# EAGLE design controller (EAGLE 7.3.0)
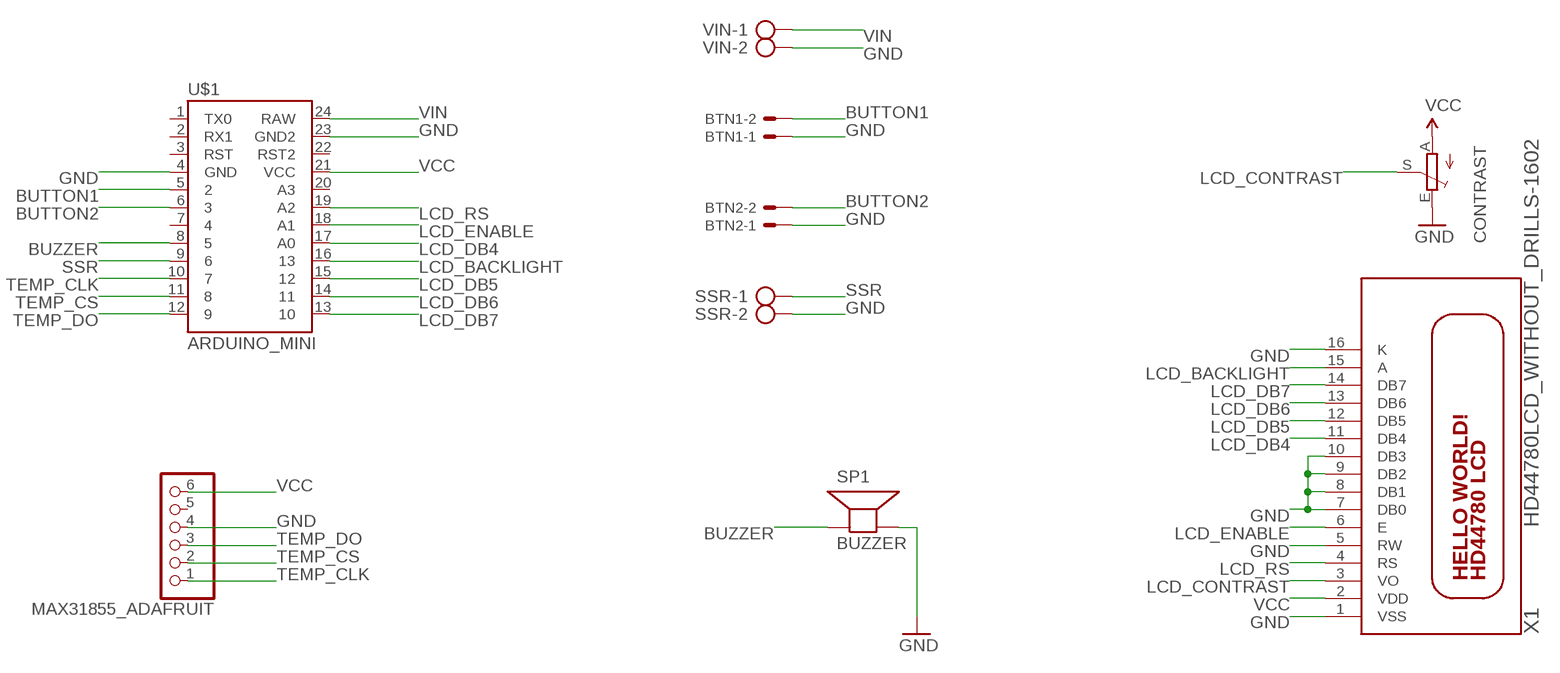
[diagram p0: schematic, sheet 1]

## Parts
BTN1  22-27-2021-02  [6410-02]
BTN2  22-27-2021-02  [6410-02]
CONTRAST  TRIM_EU-B25U  [B25U]
MAX31855_ADAFRUIT  PINHD-1X6  [1X06]
SP1  BUZZER  SPEAKER/PS12  [PS12]
SSR  AK500/2  [AK500/2]
U$1  ARDUINO_MINI  [ARDUINO_MINI]
VIN  AK500/2  [AK500/2]
X1  HD44780LCD_WITHOUT_DRILLS-1602  [LCD1602]

## Nets
BUTTON1: BTN1.2 U$1.5
BUTTON2: BTN2.2 U$1.6
BUZZER: SP1.P$1(+) U$1.8
GND: BTN1.1 BTN2.1 CONTRAST.E MAX31855_ADAFRUIT.4 SP1.P$2(-) SSR.2 U$1.4(GND) U$1.23(GND2) VIN.2 X1.1(VSS) X1.5(RW) X1.7(DB0) X1.8(DB1) X1.9(DB2) X1.10(DB3) X1.16(K)
LCD_BACKLIGHT: U$1.16 X1.15(A)
LCD_CONTRAST: CONTRAST.S X1.3(VO)
LCD_DB4: U$1.17(A0) X1.11(DB4)
LCD_DB5: U$1.15 X1.12(DB5)
LCD_DB6: U$1.14 X1.13(DB6)
LCD_DB7: U$1.13 X1.14(DB7)
LCD_ENABLE: U$1.18(A1) X1.6(E)
LCD_RS: U$1.19(A2) X1.4(RS)
SSR: SSR.1 U$1.9
TEMP_CLK: MAX31855_ADAFRUIT.1 U$1.10
TEMP_CS: MAX31855_ADAFRUIT.2 U$1.11
TEMP_DO: MAX31855_ADAFRUIT.3 U$1.12
VCC: CONTRAST.A MAX31855_ADAFRUIT.6 U$1.21(VCC) X1.2(VDD)
VIN: U$1.24(RAW) VIN.1
Unconnected: MAX31855_ADAFRUIT.5 U$1.1(TX0) U$1.2(RX1) U$1.3(RST) U$1.7 U$1.20(A3) U$1.22(RST2)

## Library data of the parts
BTN1 BTN2 = kalanda:22-?-02: CONNECTOR wire to board 2.54 mm (.1 inch) pitch header
CONTRAST = kalanda:TRIM_EU-: POTENTIOMETER
MAX31855_ADAFRUIT = pinhead:PINHD-1X6: PIN HEADER
SP1 = adafruit:SPEAKER: SPEAKER Source: Buerklin Added PS12 (for part # PS1240 piezo) http://www.ladyada.net/library/pcb/eaglelibrary.html
SSR VIN = con-ptr500:AK500/2: CONNECTOR; OC_FARNELL: unknown; OC_NEWARK: unknown
U$1 = SparkFun-Boards:ARDUINO_MINI: Arduino Pro Mini footprint
X1 = kalanda:HD44780LCD_WITHOUT_DRILLS: HD44780 LCD Standard character type LCDs, available in sizes from 8x1 to 40x4!

## Net classes
0 default: clearance 0.205 mm

## Board
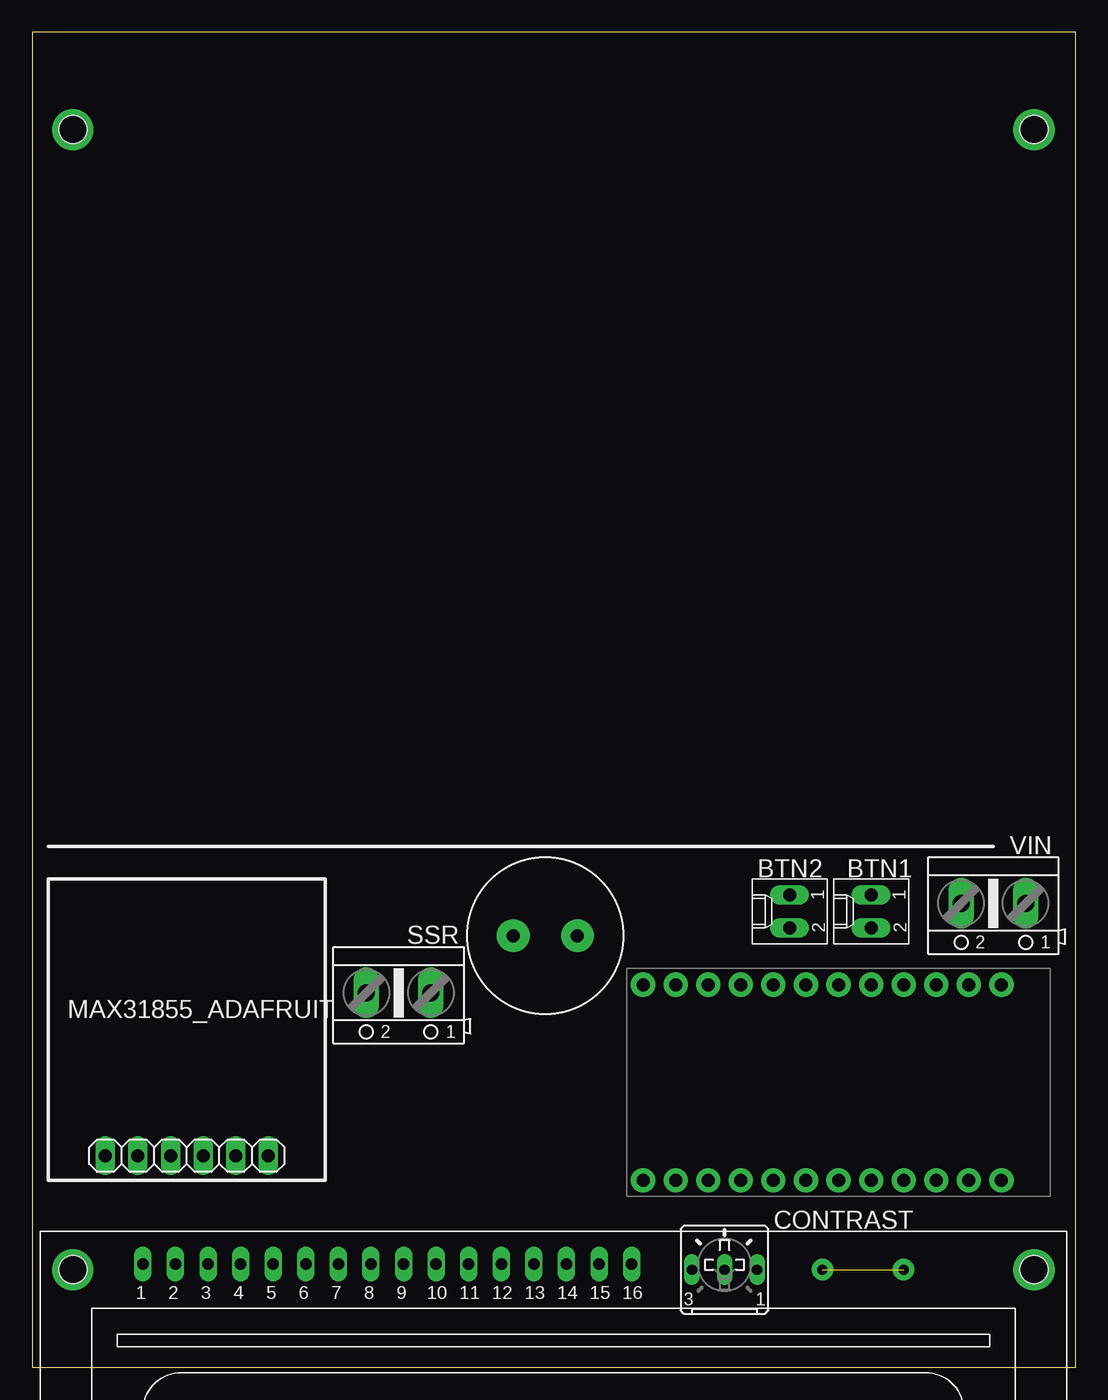
[diagram p1: board, top side]
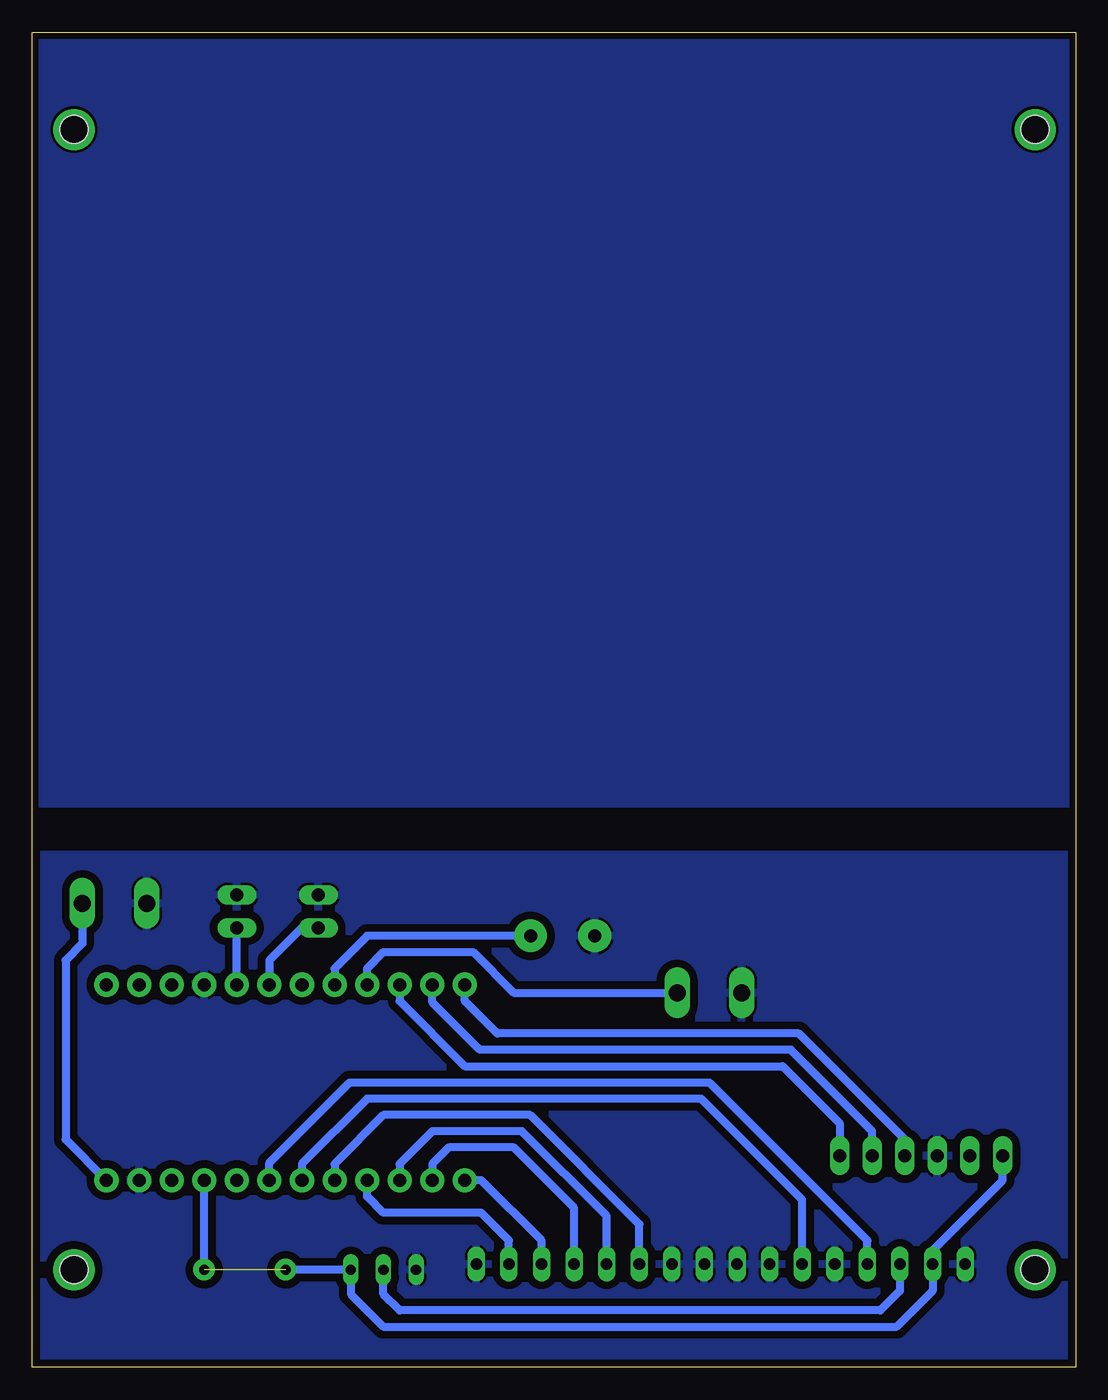
[diagram p2: board, bottom side, seen from below]

Size 81.36 x 104.13 mm. Coordinates in mm from the lower left corner, seen from the top.
Outline: 0,0 81.36,0 81.36,104.13 0,104.13 0,0
Copper layers (1*16): Top 0.035mm / dielectric 1.5mm / Bottom 0.035mm
Design rules "PCBCart-Standard": minimum track width 8mil, minimum drill 0.4mm, track to track 8mil, track to pad 8mil, pad to pad 8mil, via to via 8mil, smd to smd 8mil, copper to edge 20mil, drill to drill 8mil, minimum pad ring 8mil, minimum via ring 10mil, stop-mask expansion 3mil, vias tented up to drill 0mil, thermal gap 8mil
Holes 2.2 mm at 3.17,96.52 78.11,96.52 3.17,7.62 78.11,7.62

### Footprints (pad centres in the part's own frame; a part is rotated, then mirrored left to right if it is on the bottom)
6410-02 = drill 1.016 long: 1 1.27,0; 2 -1.27,0
B25U = drill 0.8 long: A 2.54,0; E -2.54,0; S 0,0
1X06 = drill 1.016 long: 1 -6.35,0; 2 -3.81,0; 3 -1.27,0; 4 1.27,0; 5 3.81,0; 6 6.35,0
PS12 = drill 1 pad 2.54: P$1 -2.5,0; P$2 2.5,0
AK500/2 = drill 1.321 long: 1 -2.515,0; 2 2.515,0
ARDUINO_MINI = drill 1.016 pad 1.88: 1 -7.62,12.7; 2 -7.62,10.16; 3 -7.62,7.62; 4 -7.62,5.08; 5 -7.62,2.54; 6 -7.62,0; 7 -7.62,-2.54; 8 -7.62,-5.08; 9 -7.62,-7.62; 10 -7.62,-10.16; 11 -7.62,-12.7; 12 -7.62,-15.24; 13 7.62,-15.24; 14 7.62,-12.7; 15 7.62,-10.16; 16 7.62,-7.62; 17 7.62,-5.08; 18 7.62,-2.54; 19 7.62,0; 20 7.62,2.54; 21 7.62,5.08; 22 7.62,7.62; 23 7.62,10.16; 24 7.62,12.7
LCD1602 = drill 0.9 long: 1 8,33.46; 2 10.54,33.46; 3 13.08,33.46; 4 15.62,33.46; 5 18.16,33.46; 6 20.7,33.46; 7 23.24,33.46; 8 25.78,33.46; 9 28.32,33.46; 10 30.86,33.46; 11 33.4,33.46; 12 35.94,33.46; 13 38.48,33.46; 14 41.02,33.46; 15 43.56,33.46; 16 46.1,33.46

### Placement (x,y rotation side)
BTN1  65.41,35.56 90 top
BTN2  59.05,35.56 90 top
CONTRAST  53.98,7.62 0 top
MAX31855_ADAFRUIT  12.06,16.51 180 top
SP1  40.01,33.66 180 top
SSR  28.57,29.21 180 top
U$1  62.87,22.23 270 top
VIN  74.93,36.2 180 top
X1  0.64,-25.4 0 top

### Tracks (layer width: path | path; a pad name or v marks a point on that pad's centre or on a via)
BUTTON1
  Bottom 0.61: U$1.5 BTN1.2
BUTTON2
  Bottom 0.61: BTN2.2 60.33,34.29 62.87,31.75 U$1.6
BUZZER
  Bottom 0.61: SP1.P$1 55.24,33.66 57.78,31.11 U$1.8
GND
  pour Bottom (isolate 0.61): 0,0 81.28,0 81.28,40.01 0,40.01
LCD_BACKLIGHT
  Bottom 0.61: X1.15 44.2,9.9 46.35,12.06 53.98,12.06 55.24,13.34 U$1.16
LCD_CONTRAST
  Bottom 0.61: X1.3 13.71,5.97 15.24,4.45 52.7,4.45 53.98,5.71 CONTRAST.S
LCD_DB4
  Bottom 0.61: X1.11 34.03,11.18 42.55,19.68 53.98,19.68 57.78,15.88 U$1.17
LCD_DB5
  Bottom 0.61: X1.12 36.58,11.81 43.18,18.41 50.16,18.41 52.7,15.88 U$1.15
LCD_DB6
  Bottom 0.61: X1.13 39.12,12.45 43.81,17.14 48.9,17.14 50.16,15.88 U$1.14
LCD_DB7
  Bottom 0.61: X1.14 41.66,9.9 46.35,14.61 U$1.13
LCD_ENABLE
  Bottom 0.61: X1.6 21.34,13.08 29.21,20.95 55.24,20.95 60.33,15.88 U$1.18
LCD_RS
  Bottom 0.61: U$1.19 62.87,15.97 56.61,22.23 28.57,22.23 16.25,9.9 X1.4
N$1
  pour Bottom: 0,104.14 0,43.81 81.28,43.81 81.28,104.14
N$2  (via drill 2.2)
  other vias: 3.17,96.52
N$4  (via drill 2.2)
  other vias: 78.11,96.52
N$5  (via drill 2.2)
  other vias: 78.11,7.62
N$6  (via drill 2.2)
  other vias: 3.17,7.62
SSR
  Bottom 0.61: U$1.9 55.24,31.11 53.98,32.38 46.99,32.38 43.81,29.21 SSR.1
TEMP_CLK
  Bottom 0.61: U$1.10 52.7,28.57 47.62,23.5 22.86,23.5 18.41,19.05 MAX31855_ADAFRUIT.1
TEMP_CS
  Bottom 0.61: MAX31855_ADAFRUIT.2 15.88,18.41 22.23,24.77 46.46,24.77 50.16,28.47 U$1.11
TEMP_DO
  Bottom 0.61: MAX31855_ADAFRUIT.3 13.34,17.78 21.59,26.04 45.09,26.04 47.62,28.57 U$1.12
VCC  (via drill 0.8 pad 1.68)  (1 unrouted)
  Bottom 0.61: MAX31855_ADAFRUIT.6 5.71,14.61 11.18,9.14 X1.2 11.18,5.97 13.97,3.17 53.98,3.17 56.52,5.71 CONTRAST.A v61.59,7.62 | v67.94,7.62 U$1.21
VIN
  Bottom 0.61: VIN.1 77.44,33.05 78.74,31.75 78.74,17.78 U$1.24